# Altium project bc95.PrjPCB
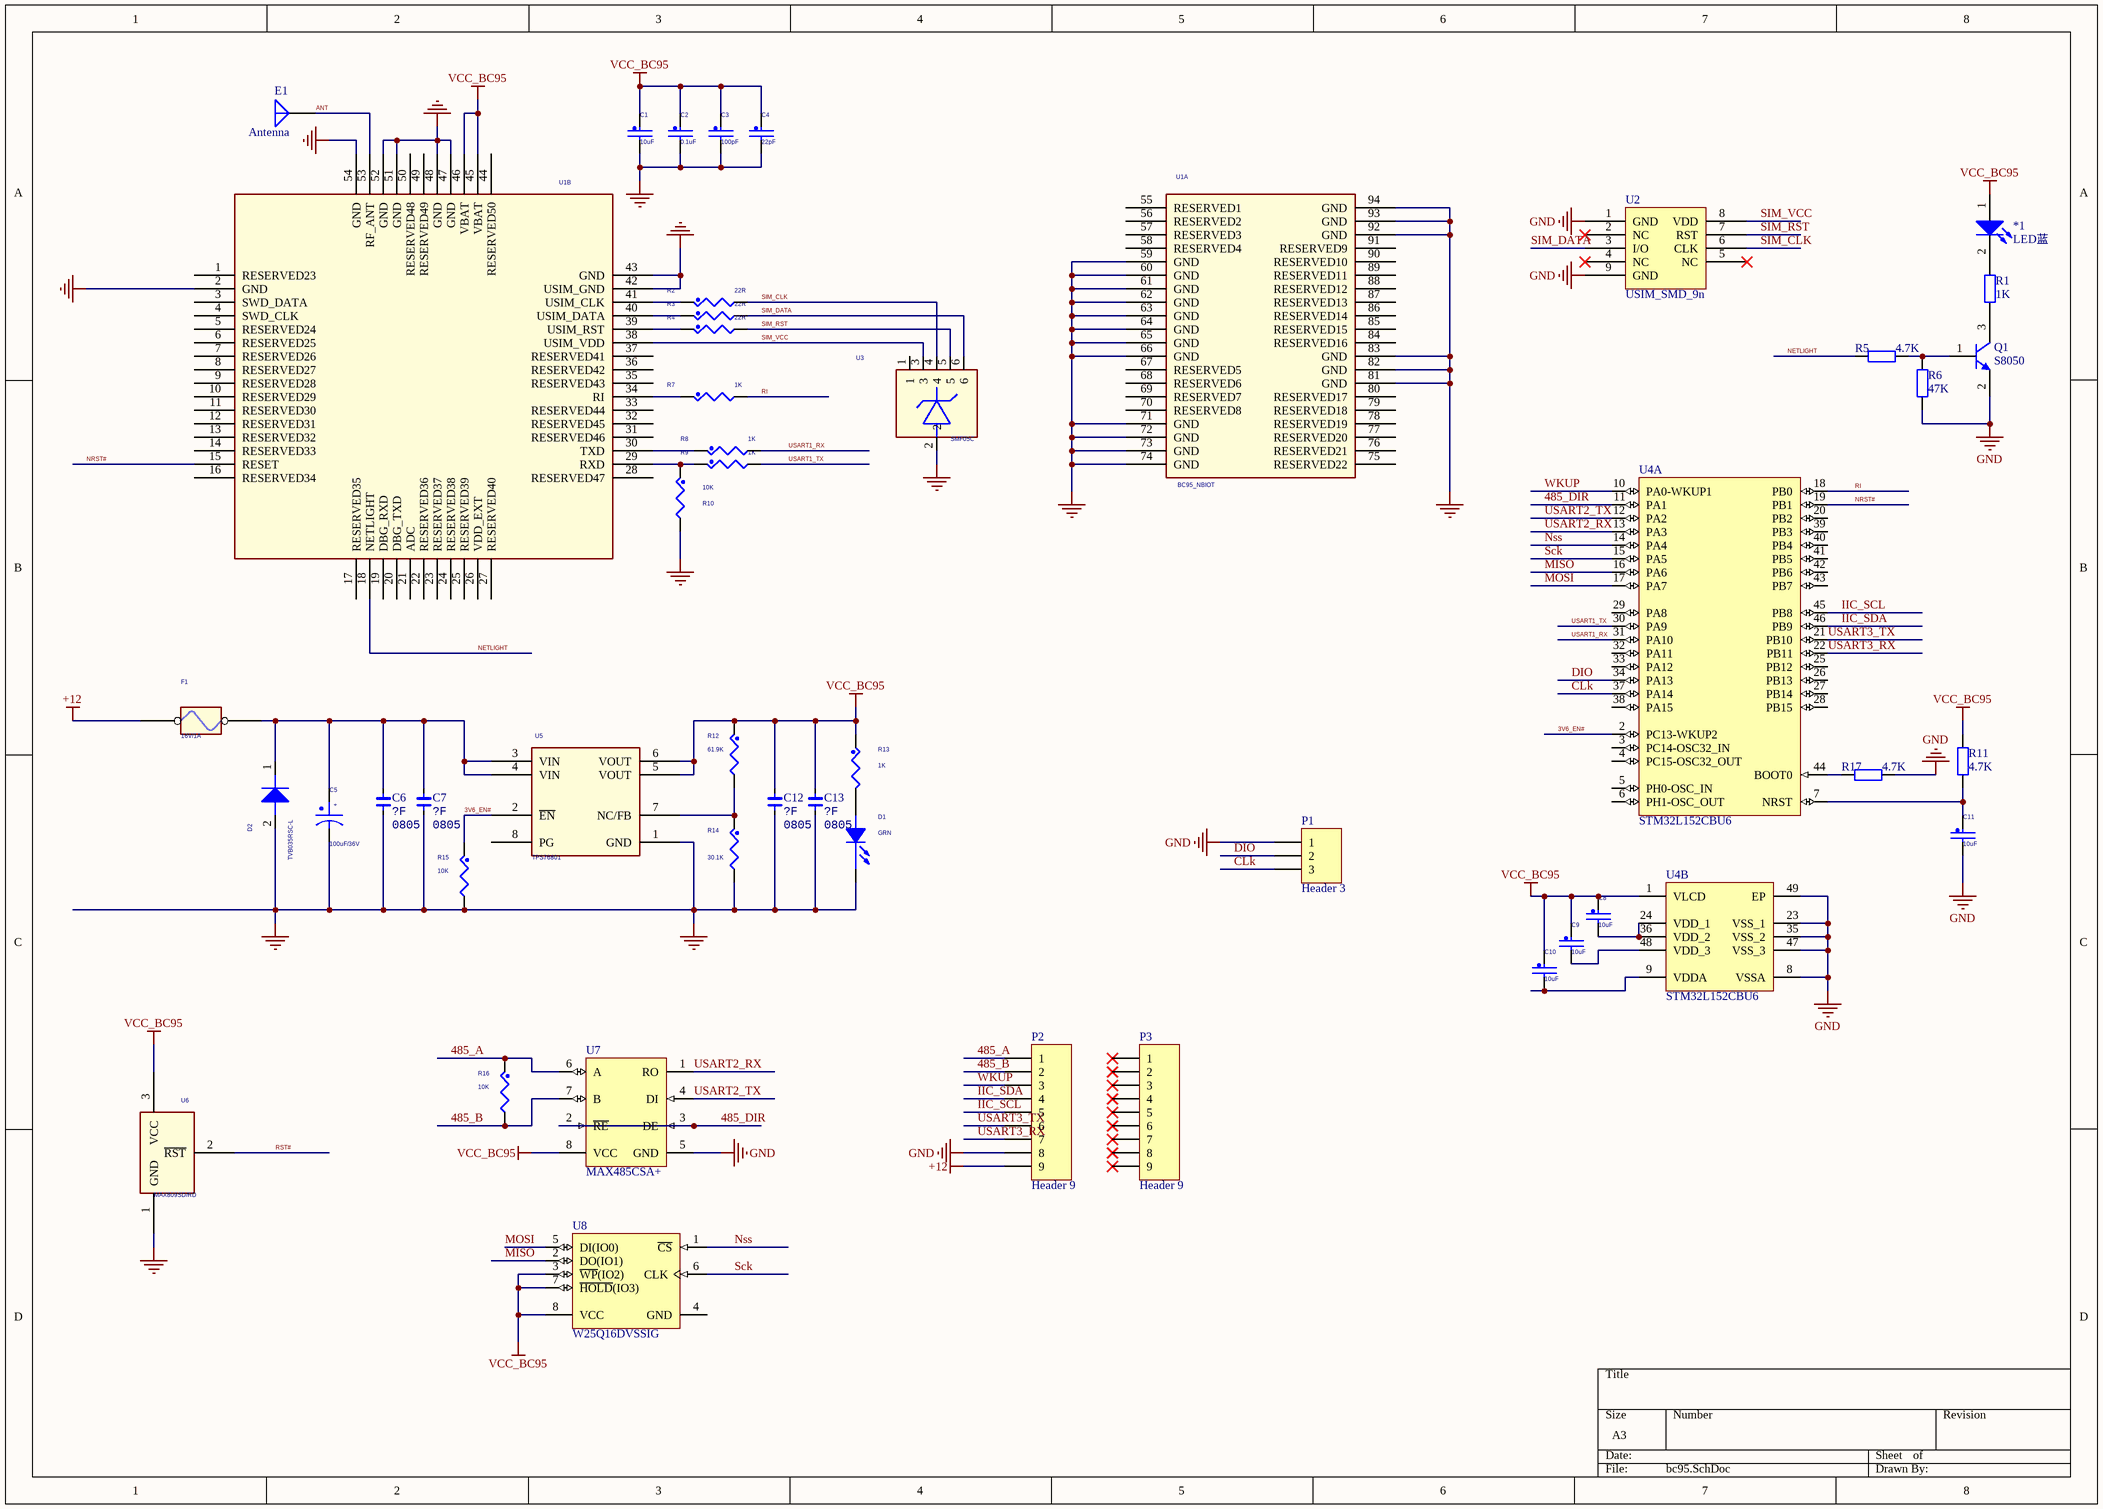
[diagram p0: bc95.SchDoc]
1 sheet, 47 parts. Net scope: global (net labels, ports and power ports of the same name join across sheets).
Board file: bc95.PcbDoc

## Sheet bc95.SchDoc
size A3

### Parts
*1  LED蓝  [LED_0603_BLUE]
C1  10uF  [CAP_0603]
C2  0.1uF  [CAP_0603]
C3  100pF  [CAP_0603]
C4  22pF  [CAP_0603]
C5  100uF/36V  [CAP_TAN_D2917]
C6  Type: 0805  [CAP_0805]  (hidden comment: ?F)
C7  Type: 0805  [CAP_0805]  (hidden comment: ?F)
C8  10uF  [CAP_0603]
C9  10uF  [CAP_0603]
C10  10uF  [CAP_0603]
C11  10uF  [CAP_0603]
C12  Type: 0805  [CAP_0805]  (hidden comment: ?F)
C13  Type: 0805  [CAP_0805]  (hidden comment: ?F)
D1  GRN  [LED_0603_GREEN]
D2  TVB035RSC-L  [IND_1008]
E1  Antenna  [IPX]
F1  16V/1A  [RES_0805]
P1  Header 3  [HDR1X3]
P2  Header 9  [HDR1X9]
P3  Header 9  [HDR1X9]
Q1  S8050  [SOT23_M]
R1  1K  [RES_0603]
R2  22R  [RES_0603]
R3  22R  [RES_0603]
R4  22R  [RES_0603]
R5  4.7K  [RES_0603]
R6  47K  [RES_0603]
R7  1K  [RES_0603]
R8  1K  [RES_0603]
R9  1K  [RES_0603]
R10  10K  [RES_0603]
R11  4.7K  [RES_0603]
R12  61.9K  [RES_0603]
R13  1K  [RES_0603]
R14  30.1K  [RES_0603]
R15  10K  [RES_0603]
R16  10K  [RES_0603]
R17  4.7K  [RES_0603]
U1  BC95_NBIOT  [BC95]  (parts A,B of 2)
U2  USIM_SMD_9n  [SON127P600X75_HS-9N]
U3  SMF05C  [SOT65P210X100-6N]
U4  STM32L152CBU6  [STM-UFQFPN48_M]  (parts A,B of 2)
U5  TPS76801  [SO8_M]
U6  MAX809SD/RD  [SOT23_M]
U7  MAX485CSA+  [MAXM-MAX485CSA+-8_M]
U8  W25Q16DVSSIG  [WINB-W25Q16DVSSIG-8_M]

### Nets
+12: F1.1 P2.9
GND: C1.2 C2.2 C3.2 C4.2 C5.2 C6.1 C7.1 C11.2 C12.1 C13.1 D1.1(CATHODE) D2.2(ANODE) P1.1 P2.8 Q1.2(E) R6.2 R10.2 R14.2 R15.2 R17.1 U1.2(GND) U1.42(USIM_GND) U1.43(GND) U1.47(GND) U1.48(GND) U1.51(GND) U1.52(GND) U1.54(GND) U1.59(GND) U1.60(GND) U1.61(GND) U1.62(GND) U1.63(GND) U1.64(GND) U1.65(GND) U1.66(GND) U1.71(GND) U1.72(GND) U1.73(GND) U1.74(GND) U1.81(GND) U1.82(GND) U1.83(GND) U1.92(GND) U1.93(GND) U1.94(GND) U2.1(GND) U2.9(GND) U3.2 U4.8(VSSA) U4.23(VSS_1) U4.35(VSS_2) U4.47(VSS_3) U4.49(EP) U5.1(GND) U6.1(GND) U7.5(GND)
VCC_BC95: *1.1 C1.1 C2.1 C3.1 C4.1 C8.1 C9.1 C10.1 C12.2 C13.2 R11.1 R12.1 R13.1 U1.45(VBAT) U1.46(VBAT) U4.1(VLCD) U5.5(VOUT) U5.6(VOUT) U6.3(VCC) U7.8(VCC) U8.3(~{WP}(IO2)) U8.7(~{HOLD}(IO3)) U8.8(VCC)
3V6_EN#: R15.1 U4.2(PC13-WKUP2) U5.2(~{EN})
485_A: P2.1 R16.1 U7.6(A)
485_B: P2.2 R16.2 U7.7(B)
485_DIR: U4.11(PA1) U7.2(~{RE}) U7.3(DE)
ANT: E1.1(A) U1.53(RF_ANT)
CLk: P1.3 U4.37(PA14)
DIO: P1.2 U4.34(PA13)
IIC_SCL: P2.5 U4.45(PB8)
IIC_SDA: P2.4 U4.46(PB9)
MISO: U4.16(PA6) U8.2(DO(IO1))
MOSI: U4.17(PA7) U8.5(DI(IO0))
NETLIGHT: R5.2 U1.18(NETLIGHT)
NRST#: U1.15(RESET) U4.19(PB1)
Nss: U4.14(PA4) U8.1(~{CS})
RI: R7.2 U4.18(PB0)
RST#: U6.2(~{RST})
Sck: U4.15(PA5) U8.6(CLK)
SIM_CLK: R2.2 U2.6(CLK) U3.4
SIM_DATA: R3.2 U2.3(I/O) U3.6
SIM_RST: R4.2 U2.7(RST) U3.5
SIM_VCC: U1.38(USIM_VDD) U2.8(VDD) U3.3
USART1_RX: R8.2 U4.31(PA10)
USART1_TX: R9.2 U4.30(PA9)
USART2_RX: U4.13(PA3) U7.1(RO)
USART2_TX: U4.12(PA2) U7.4(DI)
USART3_RX: P2.7 U4.22(PB11)
USART3_TX: P2.6 U4.21(PB10)
WKUP: P2.3 U4.10(PA0-WKUP1)
Net*1_2: *1.2 R1.2
NetC5_1: C5.1 C6.2 C7.2 D2.1(CATHODE) F1.2 U5.3(VIN) U5.4(VIN)
NetC8_2: C8.2 U4.24(VDD_1) U4.36(VDD_2)
NetC9_2: C9.2 U4.48(VDD_3)
NetC10_2: C10.2 U4.9(VDDA)
NetC11_1: C11.1 R11.2 U4.7(NRST)
NetD1_2: D1.2(ANODE) R13.2
NetQ1_1: Q1.1(B) R5.1 R6.1
NetQ1_3: Q1.3(C) R1.1
NetR2_1: R2.1 U1.41(USIM_CLK)
NetR3_1: R3.1 U1.40(USIM_DATA)
NetR4_1: R4.1 U1.39(USIM_RST)
NetR7_1: R7.1 U1.34(RI)
NetR8_1: R8.1 U1.30(TXD)
NetR9_1: R9.1 R10.1 U1.29(RXD)
NetR12_2: R12.2 R14.1 U5.7(NC/FB)
NetR17_2: R17.2 U4.44(BOOT0)

Not connected (* = marked no-connect by the designer): P3 1* 2* 3* 4* 5* 6* 7* 8* 9*; U1 1(RESERVED23) 3(SWD_DATA) 4(SWD_CLK) 5(RESERVED24) 6(RESERVED25) 7(RESERVED26) 8(RESERVED27) 9(RESERVED28) 10(RESERVED29) 11(RESERVED30) 12(RESERVED31) 13(RESERVED32) 14(RESERVED33) 16(RESERVED34) 17(RESERVED35) 19(DBG_RXD) 20(DBG_TXD) 21(ADC) 22(RESERVED36) 23(RESERVED37) 24(RESERVED38) 25(RESERVED39) 26(VDD_EXT) 27(RESERVED40) 28(RESERVED47) 31(RESERVED46) 32(RESERVED45) 33(RESERVED44) 35(RESERVED43) 36(RESERVED42) 37(RESERVED41) 44(RESERVED50) 49(RESERVED49) 50(RESERVED48) 55(RESERVED1) 56(RESERVED2) 57(RESERVED3) 58(RESERVED4) 67(RESERVED5) 68(RESERVED6) 69(RESERVED7) 70(RESERVED8) 75(RESERVED22) 76(RESERVED21) 77(RESERVED20) 78(RESERVED19) 79(RESERVED18) 80(RESERVED17) 84(RESERVED16) 85(RESERVED15) 86(RESERVED14) 87(RESERVED13) 88(RESERVED12) 89(RESERVED11) 90(RESERVED10) 91(RESERVED9); U2 2(NC)* 4(NC)* 5(NC)*; U3 1; U4 3(PC14-OSC32_IN) 4(PC15-OSC32_OUT) 5(PH0-OSC_IN) 6(PH1-OSC_OUT) 20(PB2) 25(PB12) 26(PB13) 27(PB14) 28(PB15) 29(PA8) 32(PA11) 33(PA12) 38(PA15) 39(PB3) 40(PB4) 41(PB5) 42(PB6) 43(PB7); U5 8(PG); U8 4(GND)

### Notes on the sheet
- (in symbol CAP_POL) +

### Library data of the parts
C1 C8-C11 = CAP_NP: CAP 22uF 1210 25V 10%; MPN: GRM-RC1210-227K; MFG: Murata; Tolerance: 10%
C2 C4 = CAP_NP: CAP  0.1uF 0402 25V 10%; Part Number: 132-000**; MPN: GRM-RC0402-104K; CAD_APPROVED: Yes; MFG: Murata; Voltage: 25V; Size: 0402; ROHS: Yes; HEIGHT: 0.55MM; Tolerance: 10%
C3 = CAP_NP: CAP  0.1uF 0402 25V 10%; MPN: GRM-RC0402-104K; Part Number: 132-000**; MFG: Murata; CAD_APPROVED: Yes; Tolerance: 10%; HEIGHT: 0.55MM; ROHS: Yes; Size: 0402; Voltage: 25V
C5 = CAP_POL: CAP 220UF 1010mm 35V 10%; MPN: C1210C476K8PAC; MFG: Murata; Tolerance: 10%
C6 C7 C12 C13 = Cap_0805: Capacitor; Value: ?F
D1 = F5F1
D2 = DIODE: 二极管 浪涌保 dm=35V,Ih=150mA DO-214AA SMB; MFG: TYCO; MPN: TVB035RSC-L
E1 = Antenna: Generic Antenna; Published: 24-Mar-1999; LatestRevisionDate: 17-Jul-2002; LatestRevisionNote: Re-released for DXP Platform.; PackageReference: PIN1; Publisher: Altium Limited
F1 = FUSEHOLDER
P1 = Header 3: Header, 3-Pin; LatestRevisionDate: 17-Jul-2002; LatestRevisionNote: Re-released for DXP Platform.; Publisher: Altium Limited
P2 P3 = Header 9: Header, 9-Pin; LatestRevisionDate: 17-Jul-2002; LatestRevisionNote: Re-released for DXP Platform.; Publisher: Altium Limited
Q1 = QNPN: NPN Bipolar Transistor; Published: 8-Jun-2000; LatestRevisionDate: 17-Jul-2002; LatestRevisionNote: Re-released for DXP Platform.; PackageReference: SOT-23B; Publisher: Altium Limited; Code_JEDEC: SOT-23
R1 R5 R6 R11 R17 = Res: Resistor; Published: 8-Jun-2000; LatestRevisionDate: 17-Jul-2002; LatestRevisionNote: Re-released for DXP Platform.; PackageReference: AXIAL-0.4; Publisher: Altium Limited
R2 R7 R12 = RES: MPN: RC1206JR-07330R; Tolerance: 5%; MFG: Yageo; ROHS: Yes
R3 R4 R8-R10 R14-R16 = RES: MPN: RC1206JR-07330R; MFG: Yageo; Tolerance: 5%; ROHS: Yes
R13 = RES: MPN: RC0402JR-07330R; Tolerance: 5%; HEIGHT: 0.55MM
U1 = BC95_NBIOT_4
U3 = SMF05C_0
U4 = CMP-0236-00012-4: ARM Cortex-M3 32-bit MCU, 128 KB Flash, 16 KB Internal RAM, 37 I/Os, 48-pin UFQFPN, -40 to 85 degC, Tray; I/Os (High Current): 37; Internal RAM Size (kB): 16; Operating Frequency(F) (Processor speed) (MHz): 32; Data E2PROM nom (B): 4096; D/A Converter: 2x12-bit (2 Channel); FLASH Size (Prog) (kB): 128; Supply Voltage(Vcc) min (V): 1.65; ComponentLink3Description: Package Specification; Packing: Tray; ComponentLink1Description: Manufacturer URL; DatasheetVersion: Rev. 8; PackageDescription: 48-Pin Ultra Thin Fine Pitch Quad Flat No-Lead, 7 x 7 x 0.6 mm Body, 0.5 mm Pitch, Exposed Pad; ComponentLink2URL: http://www.st.com/st-web-ui/static/active/en/resource/technical/document/datasheet/CD00277537.pdf; PartNumber: STM32L152CBU6; Core: ARM Cortex-M3; ComponentLink3URL: http://www.st.com/st-web-ui/static/active/en/resource/technical/document/data_brief/DM00071938.pdf; Mounting Technology: Surface Mount; PackageReference: UFQFPN48; ComponentLink2Description: Datasheet; ComponentLink1URL: http://www.st.com/web/en/home.html; PackageVersion: Rev. 1, 04/2013; PartId: 1
U5 = TPS768XX_1
U7 = CMP-2000-05211-1: Low-Power, Slew-Rate-Limited RS-485/RS-422 Transceiver, 4.75 to 5.25 V, 0 to 70 degC, 8-Pin SOIC, RoHS, Tape and Reel; Manufacturer: Maxim; No. of Receivers: 1; Transceiver Type: Differential; Supply Voltage Min: 4.75V; IC Generic Number: 485; IC Temperature Range: Commercial; No. of Pins: 8; Supply Voltage Range: 4.75Vto5.25V; Interface: RS-422/RS-485; Supply Voltage Max: 5.25V; Data Rate: 2.5Mbps; Line / Bus Driver / Receiver / Transceiver Type: CMOSDifferential; Supply Current: 500µA; Interface Type: RS422,RS485; Device Type: Transceiver; Manufacturer URL: http://www.maximintegrated.com/; Operating Temperature Range: 0degCto+70degC; Package / Case: SOIC; Digital IC Case Style: SOIC; Operating Temperature Max: 70degC; Device Marking: MAX485CSA+; Driver Case Style: SOIC; Datasheet Version: Rev. 8, 10/2003; Operating Temperature Min: 0degC; Datasheet URL: https://datasheet.ciiva.com/29306/170071-da-01-en-ic-max485csa-so8-29306144.pdf; Base Number: 485; No. of Drivers: 1; Logic Function Number: 485
U8 = CMP-2000-05434-1: IC FLASH 16MBIT 104MHZ 8SOIC; Manufacturer: Winbond; Interface Type: Serial(SPI); Rad Hardened: No; Programmable: Yes; Supply Current: 18mA; Number of Words: 2M; Density: 16777216Bit; Word Size: 8b; Sync/Async: Synchronous; Cell Type: NOR; Operating Supply Voltage (Min): 2.7V; Boot Type: Bottom/Top; Address Bus: 24b; Program/Erase Volt (Typ): 2.7to3.6V; Access Time (Max): 7ns; Operating Supply Voltage (Max): 3.6V; Operating Supply Voltage (Typ): 3/3.3V; Mounting: SurfaceMount; Datasheet Version: Rev. D, 10/2012; Manufacturer URL: http://www.winbond.com/hq/index.html?__locale=en; Operating Temperature (Min): -40C; Operating Temperature (Max): 85C; Pin Count: 8; Package Type: SOICW; Datasheet URL: https://ciiva.com/datasheet-click-14728450?src=ciiva&sig=bd4f4644; Operating Temp Range: -40Cto85C; Operating Temperature Classification: Industrial